# Altium schematic sheet Mcu.SchDoc: SR4K_PHY6222
size A4; Revision: V1.2; SheetNumber: 2; SheetTotal: 5
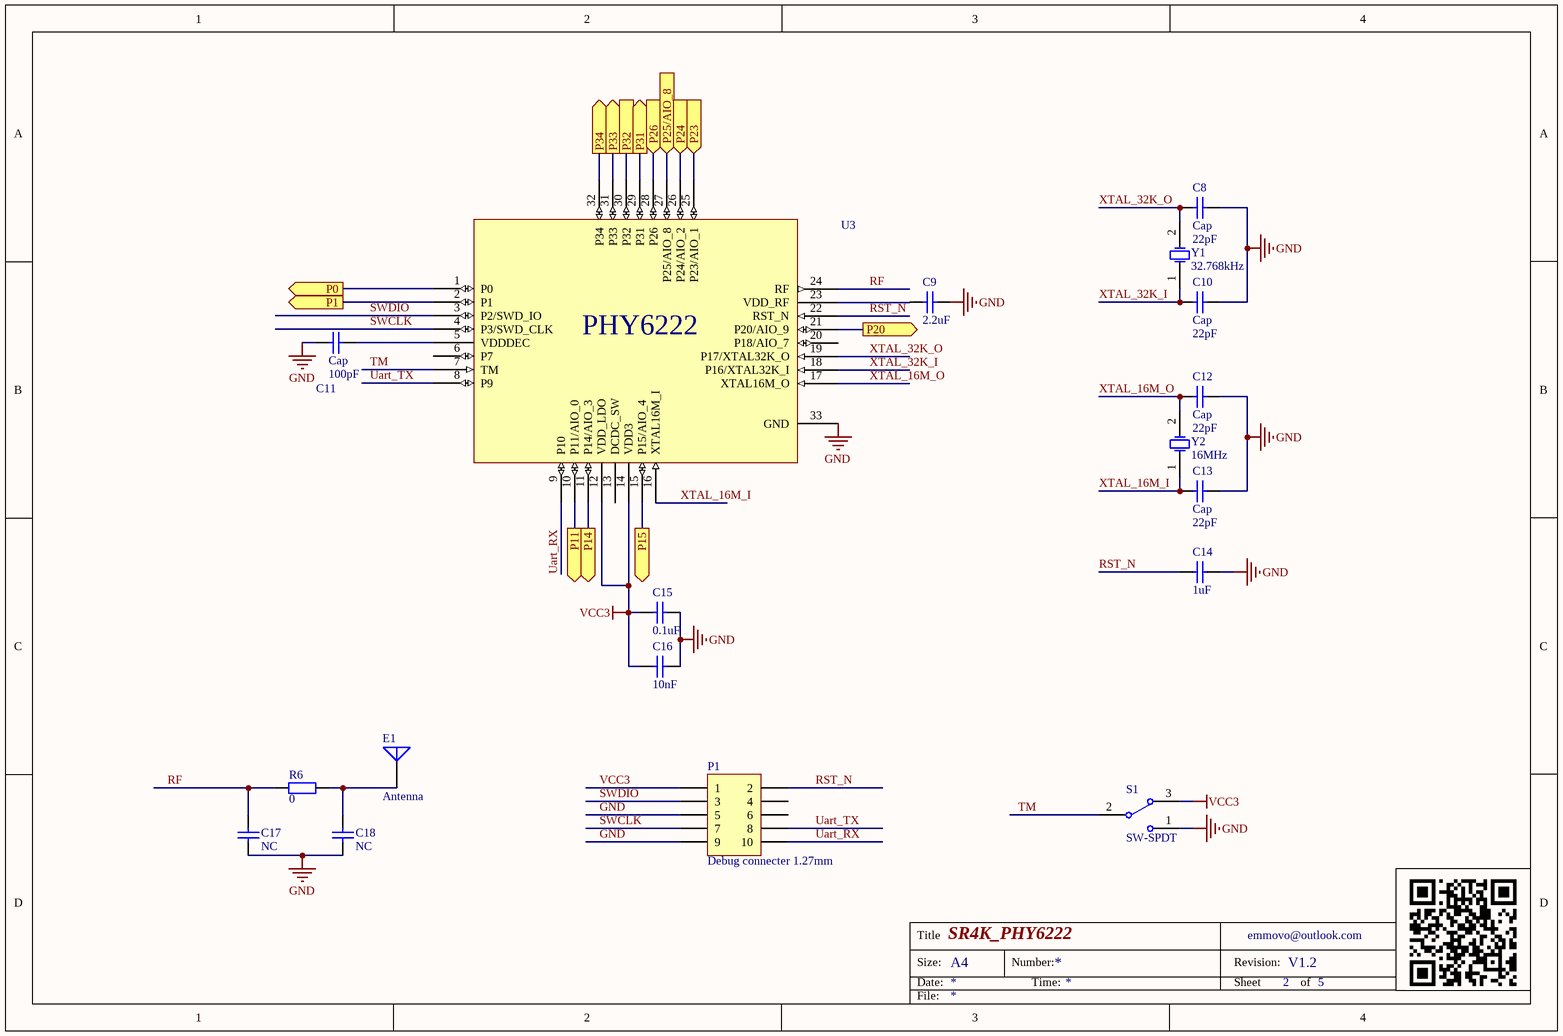
[diagram p0: Mcu.SchDoc]

## Parts
C8  Cap  value 22pF
C9  value 2.2uF  (hidden comment: Cap)
C10  Cap  value 22pF
C11  Cap  value 100pF
C12  Cap  value 22pF
C13  Cap  value 22pF
C14  value 1uF  (hidden comment: Cap)
C15  value 0.1uF  (hidden comment: Cap)
C16  value 10nF  (hidden comment: Cap)
C17  value NC  (hidden comment: Cap)
C18  value NC  (hidden comment: Cap)
E1  Antenna  [PIN1]
P1  Debug connecter 1.27mm
R6  0
S1  SW-SPDT
U3  U*  (value not drawn)
Y1  32.768kHz
Y2  16MHz

## Ports
P0 (out), P1 (out), P11 (out), P14 (out), P15 (out), P20 (out), P23 (in), P24 (in), P25/AIO_8 (in), P26 (in), P31 (out), P32, P33 (out), P34 (out)

## Nets
GND: C8.1 C9.2 C10.1 C11.1 C12.1 C13.1 C14.2 C15.2 C16.2 C17.2 C18.2 P1.5 P1.9 S1.1 U3.33(GND)
VCC3: P1.1 S1.3
P0: U3.1(P0) ; port P0
P1: U3.2(P1) ; port P1
P11: U3.10(P11/AIO_0) ; port P11
P14: U3.11(P14/AIO_3) ; port P14
P15: U3.15(P15/AIO_4) ; port P15
P20: U3.21(P20/AIO_9) ; port P20
P23: U3.25(P23/AIO_1) ; port P23
P24: U3.26(P24/AIO_2) ; port P24
P25/AIO_8: U3.27(P25/AIO_8) ; port P25/AIO_8
P26: U3.28(P26) ; port P26
P31: U3.29(P31) ; port P31
P32: U3.30(P32) ; port P32
P33: U3.31(P33) ; port P33
P34: U3.32(P34) ; port P34
RF: C17.1 R6.2 U3.24(RF)
RST_N: C14.1 P1.2 U3.22(RST_N)
SWCLK: P1.7 U3.4(P3/SWD_CLK)
SWDIO: P1.3 U3.3(P2/SWD_IO)
TM: S1.2 U3.7(TM)
Uart_RX: P1.10 U3.9(P10)
Uart_TX: P1.8 U3.8(P9)
XTAL_16M_I: C13.2 U3.16(XTAL16M_I) Y2.1(OSC1)
XTAL_16M_O: C12.2 U3.17(XTAL16M_O) Y2.2(OSC2)
XTAL_32K_I: C10.2 U3.18(P16/XTAL32K_I) Y1.1(OSC1)
XTAL_32K_O: C8.2 U3.19(P17/XTAL32K_O) Y1.2(OSC2)
NetC9_1: C9.1 U3.23(VDD_RF)
NetC11_2: C11.2 U3.5(VDDDEC)
NetC15_1: C15.1 C16.1 U3.12(VDD_LDO) U3.14(VDD3)
NetC18_1: C18.1 E1.1(A) R6.1

Not connected (* = marked no-connect by the designer): P1 4 6; U3 6(P7) 13(DCDC_SW) 20(P18/AIO_7)

## Notes on the sheet
- Labels drawn without touching a wire or pin: VCC3
- Title
- Size:
- Date:
- A4
- Number:
- Time:
- Revision:
- Sheet
- emmovo@outlook.com
- of
- File:

## Library data of the parts
C8-C18 = Cap: Capacitor; Published: 8-Jun-2000; LatestRevisionDate: 17-Jul-2002; LatestRevisionNote: Re-released for DXP Platform.; PackageReference: RAD-0.3; Publisher: Altium Limited; PackageDescription: Radial Cap, Thru-Hole; 2 Leads; 0.3 in Pin Spacing
E1 = Antenna: Generic Antenna; Published: 24-Mar-1999; LatestRevisionDate: 17-Jul-2002; LatestRevisionNote: Re-released for DXP Platform.; PackageReference: PIN1; Publisher: Altium Limited
P1 = Header 5X2: Header, 5-Pin, Dual row; LatestRevisionDate: 17-Jul-2002; LatestRevisionNote: Re-released for DXP Platform.; Publisher: Altium Limited
R6 = Res2: Resistor; Published: 8-Jun-2000; LatestRevisionDate: 17-Jul-2002; LatestRevisionNote: Re-released for DXP Platform.; PackageReference: AXIAL-0.4; Publisher: Altium Limited; PackageDescription: Axial Device, Thru-Hole; 2 Leads; 0.4 in Pin Spacing; Value: 0
S1 = SW-SPDT: SPDT Subminiature Toggle Switch, Right Angle Mounting, Vertical Actuation; Published: 24-Mar-1999; LatestRevisionDate: 17-Dec-2003; LatestRevisionNote: Schematic revised, PCB Footprint replaced.; DatasheetVersion: 05-Dec-2000; PackageReference: TL36WW15050; Publisher: Altium Limited; PackageDescription: Switch; 4 Leads; ComponentLink1Description: Manufacturer Link; ComponentLink1URL: http://www.apem.com
U3 = PHY6222
Y1 Y2 = XTAL: Crystal Oscillator; Published: 8-Jun-2000; LatestRevisionDate: 17-Jul-2002; LatestRevisionNote: Re-released for DXP Platform.; PackageReference: R38; Publisher: Altium Limited; PackageDescription: Crystal, Thru-Hole; 2 Leads; Body 3.1 x 8.2 mm (Dia.xH)